# Altium schematic sheet overall.SchDoc
size A4
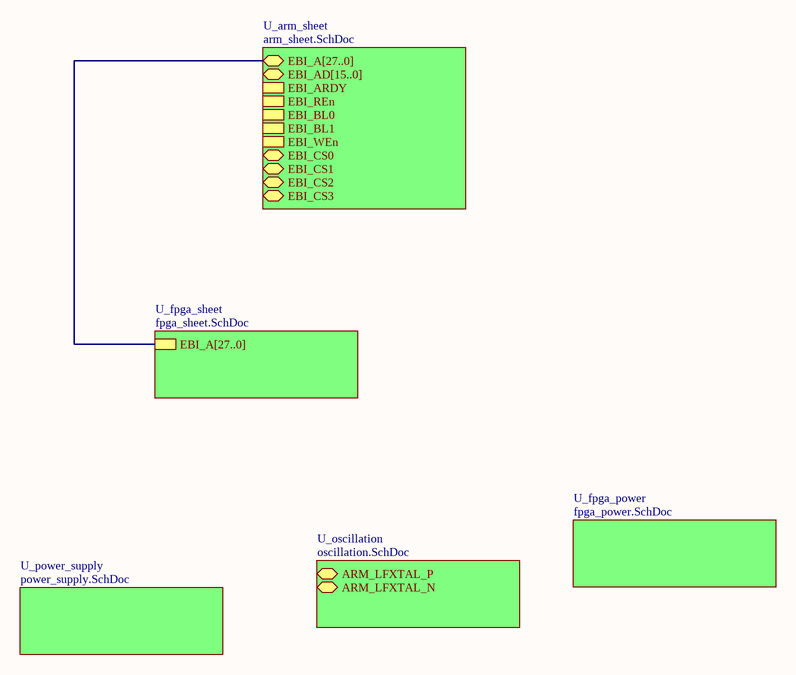
[diagram p0: overall.SchDoc]

## Sub-sheets
U_arm_sheet = arm_sheet.SchDoc: EBI_A[27..0] (bidir), EBI_AD[15..0] (bidir), EBI_ARDY, EBI_REn, EBI_BL0, EBI_BL1, EBI_WEn, EBI_CS0 (bidir), EBI_CS1 (bidir), EBI_CS2 (bidir), EBI_CS3 (bidir)
U_fpga_power = fpga_power.SchDoc: no entries
U_fpga_sheet = fpga_sheet.SchDoc: EBI_A[27..0]
U_oscillation = oscillation.SchDoc: ARM_LFXTAL_P (bidir), ARM_LFXTAL_N (bidir)
U_power_supply = power_supply.SchDoc: no entries

## Buses and harness runs
bus sheet U_arm_sheet/EBI_A[27..0] = sheet U_fpga_sheet/EBI_A[27..0]